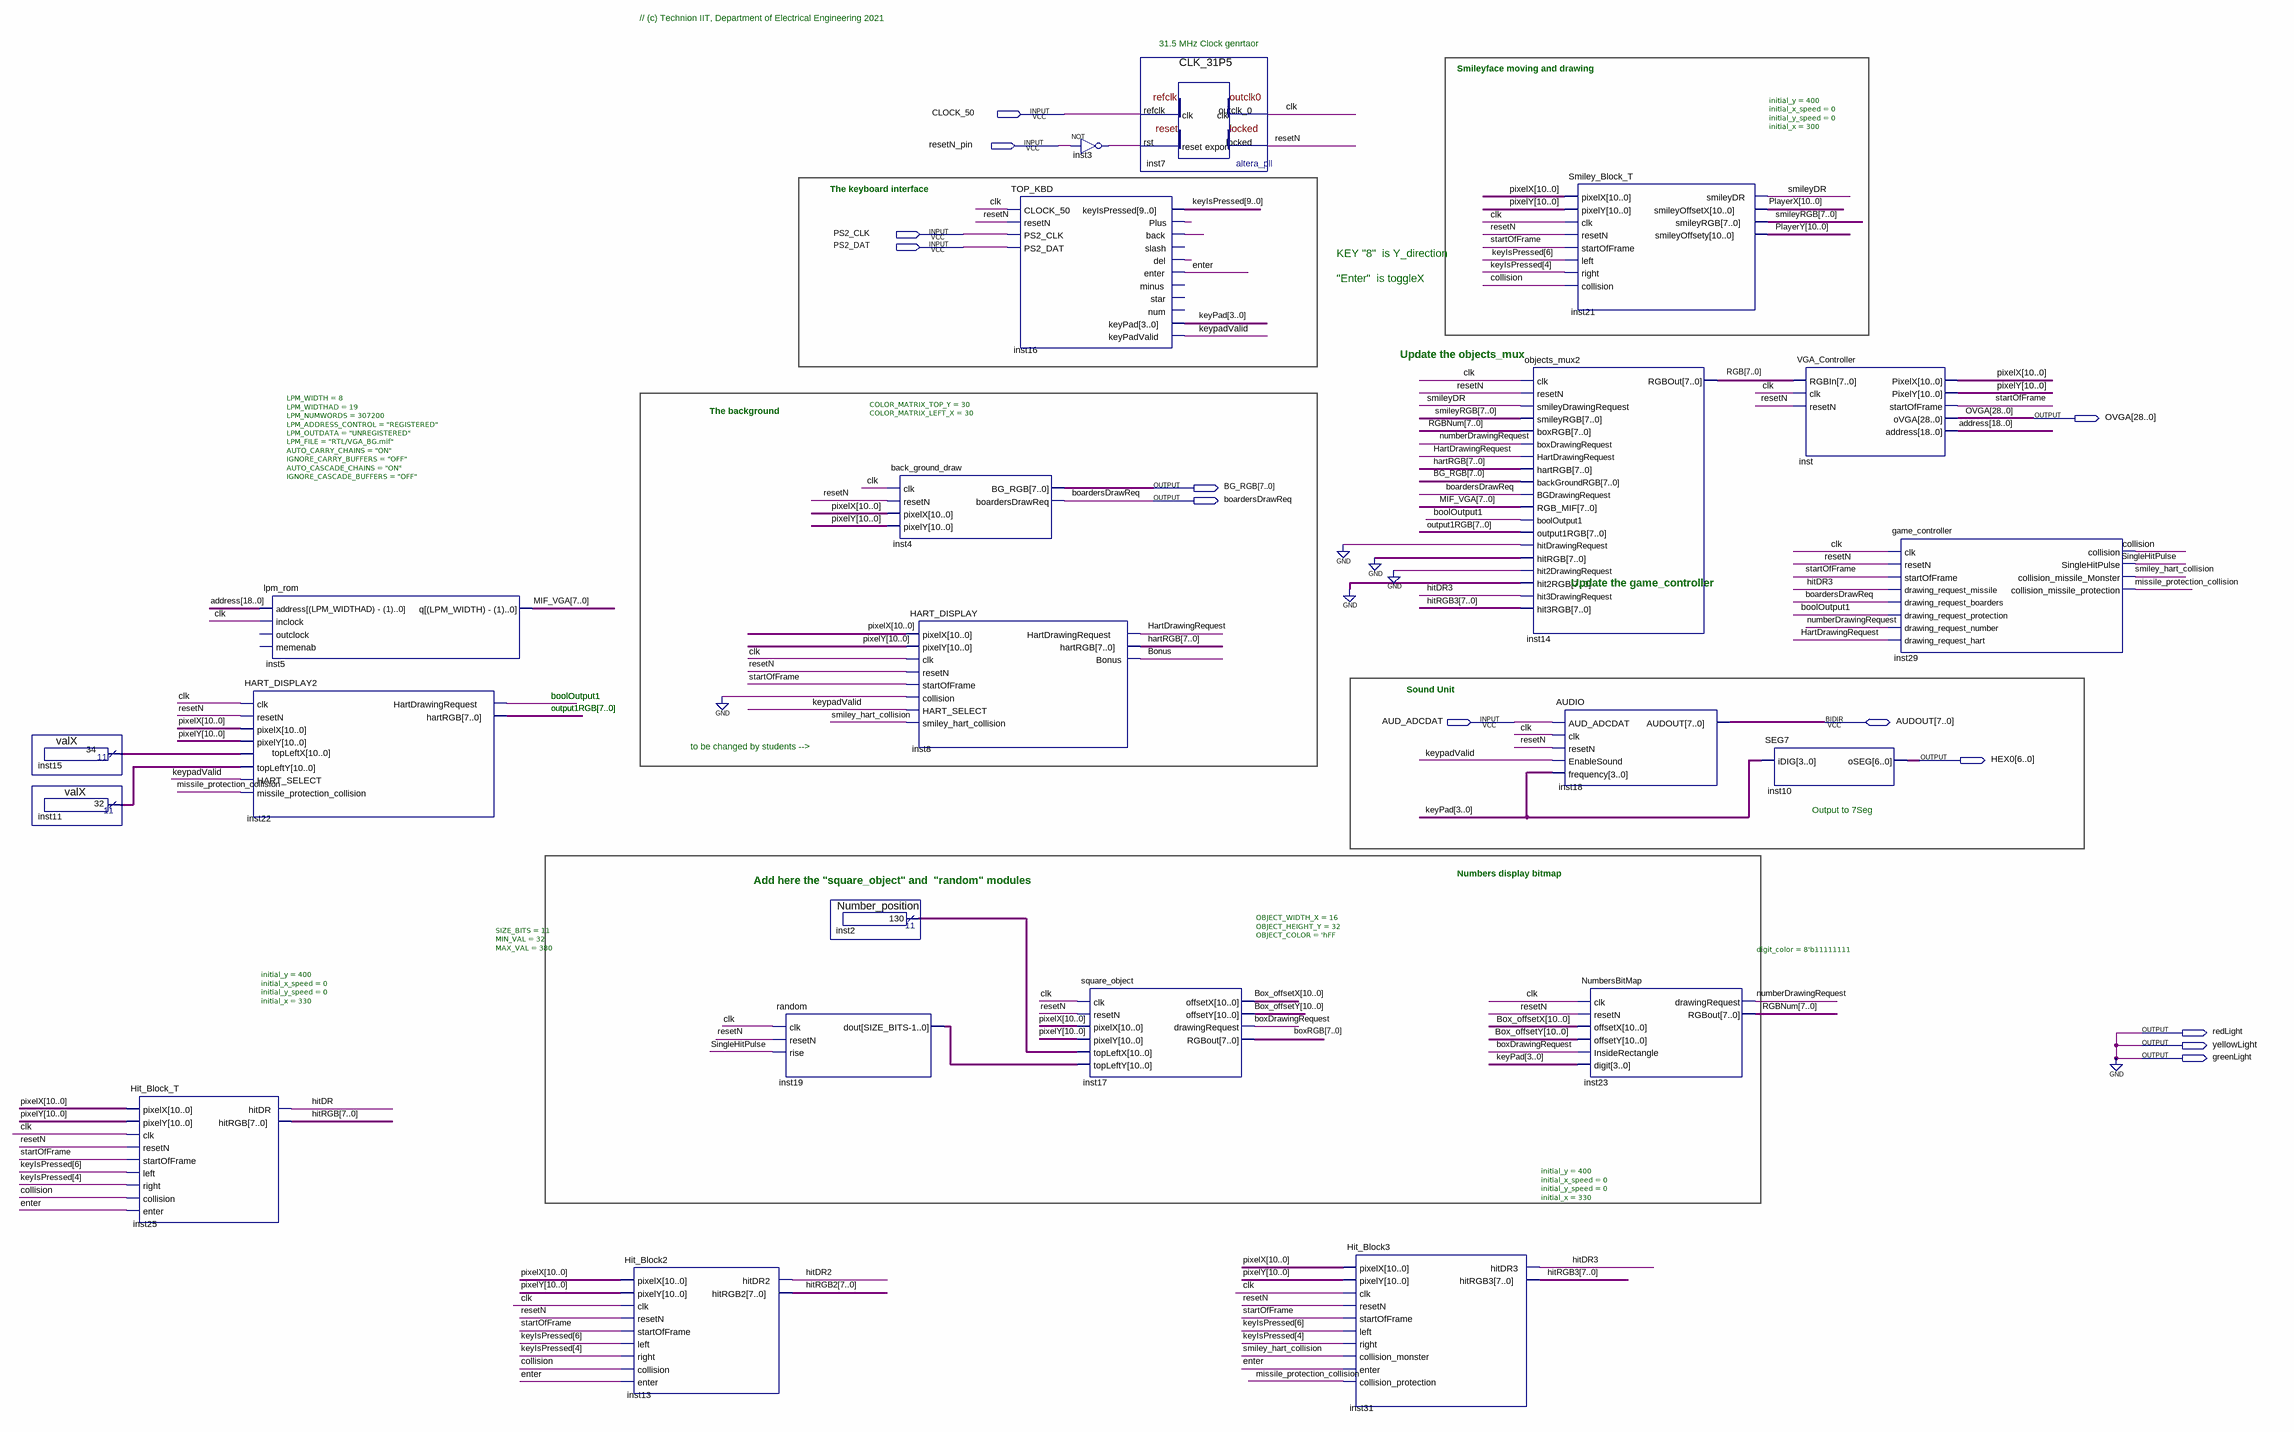
[diagram p0: schematic sheet]
// Quartus schematic TOP_VGA_DEMO_KBD.bdf as structural Verilog: 22 symbols, 13 pins
module TOP_VGA_DEMO_KBD (
  input  CLOCK_50,
  input  resetN_pin,
  input  PS2_CLK,
  input  PS2_DAT,
  input  AUD_ADCDAT,
  inout  [7:0] AUDOUT,
  output [28:0] OVGA,
  output [7:0] BG_RGB,
  output boardersDrawReq,
  output [6:0] HEX0,
  output redLight,
  output yellowLight,
  output greenLight
);

  wire Bonus, boolOutput1, boxDrawingRequest, clk, collision, enter, HartDrawingRequest, hitDR, hitDR2,
       hitDR3, inst3_out, inst16_back, inst16_del, inst16_plus, keypadValid, missile_protection_collision,
       numberDrawingRequest, resetN, SingleHitPulse, smiley_hart_collision, smileyDR, startOfFrame;
  wire [3:0] keyPad;
  wire [7:0] boxRGB, hartRGB, hitRGB, hitRGB2, hitRGB3, MIF_VGA, output1RGB, RGB, RGBNum, smileyRGB;
  wire [9:0] keyIsPressed;
  wire [10:0] Box_offsetX, Box_offsetY, inst2_result, inst11_result, inst15_result, inst19_dout, pixelX,
       pixelY, PlayerX, PlayerY;
  wire [18:0] address;

  valX inst15 (.result(inst15_result));
  valX inst11 (.result(inst11_result));
  Hit_Block_T #(.initial_y(400), .initial_x_speed(0), .initial_y_speed(0), .initial_x(330)) inst25 (
    .pixelX(pixelX), .pixelY(pixelY), .clk(clk), .resetN(resetN), .startOfFrame(startOfFrame),
    .left(keyIsPressed[6]), .right(keyIsPressed[4]), .collision(collision), .enter(enter), .hitDR(hitDR),
    .hitRGB(hitRGB));
  lpm_rom #(.LPM_WIDTH(8), .LPM_WIDTHAD(19), .LPM_NUMWORDS(307200), .LPM_ADDRESS_CONTROL("REGISTERED"), .LPM_OUTDATA("UNREGISTERED"), .LPM_FILE("RTL/VGA_BG.mif"), .AUTO_CARRY_CHAINS("ON"), .IGNORE_CARRY_BUFFERS("OFF"), .AUTO_CASCADE_CHAINS("ON"), .IGNORE_CASCADE_BUFFERS("OFF")) inst5 (
    .address(address), .inclock(clk), .q(MIF_VGA));  // open: outclock, memenab
  HART_DISPLAY2 inst22 (
    .clk(clk), .resetN(resetN), .pixelX(pixelX), .pixelY(pixelY), .topLeftX(inst15_result),
    .topLeftY(inst11_result), .HART_SELECT(keypadValid),
    .missile_protection_collision(missile_protection_collision), .HartDrawingRequest(boolOutput1),
    .hartRGB(output1RGB));
  Hit_Block2 inst13 (
    .pixelX(pixelX), .pixelY(pixelY), .clk(clk), .resetN(resetN), .startOfFrame(startOfFrame),
    .left(keyIsPressed[6]), .right(keyIsPressed[4]), .collision(collision), .enter(enter), .hitDR2(hitDR2),
    .hitRGB2(hitRGB2));
  random #(.SIZE_BITS(11), .MIN_VAL(32), .MAX_VAL(380)) inst19 (
    .clk(clk), .resetN(resetN), .rise(SingleHitPulse), .dout(inst19_dout));
  Number_position inst2 (.result(inst2_result));
  back_ground_draw #(.COLOR_MATRIX_TOP_Y(30), .COLOR_MATRIX_LEFT_X(30)) inst4 (
    .clk(clk), .resetN(resetN), .pixelX(pixelX), .pixelY(pixelY), .BG_RGB(BG_RGB),
    .boardersDrawReq(boardersDrawReq));
  HART_DISPLAY inst8 (
    .pixelX(pixelX), .pixelY(pixelY), .clk(clk), .resetN(resetN), .startOfFrame(startOfFrame),
    .collision(1'b0), .HART_SELECT(keypadValid), .smiley_hart_collision(smiley_hart_collision),
    .HartDrawingRequest(HartDrawingRequest), .hartRGB(hartRGB), .Bonus(Bonus));
  TOP_KBD inst16 (
    .CLOCK_50(clk), .resetN(resetN), .PS2_CLK(PS2_CLK), .PS2_DAT(PS2_DAT), .keyIsPressed(keyIsPressed),
    .Plus(inst16_plus), .back(inst16_back), .del(inst16_del), .enter(enter), .keyPad(keyPad),
    .keyPadValid(keypadValid));  // open: slash, minus, star, num
  not inst3 (inst3_out, resetN_pin);
  square_object #(.OBJECT_WIDTH_X(16), .OBJECT_HEIGHT_Y(32), .OBJECT_COLOR('hFF)) inst17 (
    .clk(clk), .resetN(resetN), .pixelX(pixelX), .pixelY(pixelY), .topLeftX(inst2_result),
    .topLeftY(inst19_dout), .offsetX(Box_offsetX), .offsetY(Box_offsetY), .drawingRequest(boxDrawingRequest),
    .RGBout(boxRGB));
  CLK_31P5 inst7 (.refclk(CLOCK_50), .rst(inst3_out), .outclk_0(clk), .locked(resetN));
  Hit_Block3 #(.initial_y(400), .initial_x_speed(0), .initial_y_speed(0), .initial_x(330)) inst31 (
    .pixelX(pixelX), .pixelY(pixelY), .clk(clk), .resetN(resetN), .startOfFrame(startOfFrame),
    .left(keyIsPressed[6]), .right(keyIsPressed[4]), .collision_monster(smiley_hart_collision),
    .enter(enter), .collision_protection(missile_protection_collision), .hitDR3(hitDR3), .hitRGB3(hitRGB3));
  objects_mux2 inst14 (
    .clk(clk), .resetN(resetN), .smileyDrawingRequest(smileyDR), .smileyRGB(smileyRGB), .boxRGB(RGBNum),
    .boxDrawingRequest(numberDrawingRequest), .HartDrawingRequest(HartDrawingRequest), .hartRGB(hartRGB),
    .backGroundRGB(BG_RGB), .BGDrawingRequest(boardersDrawReq), .RGB_MIF(MIF_VGA), .boolOutput1(boolOutput1),
    .output1RGB(output1RGB), .hitDrawingRequest(1'b0), .hitRGB({8{1'b0}}), .hit2DrawingRequest(1'b0),
    .hit2RGB({8{1'b0}}), .hit3DrawingRequest(hitDR3), .hit3RGB(hitRGB3), .RGBOut(RGB));
  Smiley_Block_T #(.initial_y(400), .initial_x_speed(0), .initial_y_speed(0), .initial_x(300)) inst21 (
    .pixelX(pixelX), .pixelY(pixelY), .clk(clk), .resetN(resetN), .startOfFrame(startOfFrame),
    .left(keyIsPressed[6]), .right(keyIsPressed[4]), .collision(collision), .smileyDR(smileyDR),
    .smileyOffsetX(PlayerX), .smileyRGB(smileyRGB), .smileyOffsety(PlayerY));
  AUDIO inst18 (
    .AUD_ADCDAT(AUD_ADCDAT), .clk(clk), .resetN(resetN), .EnableSound(keypadValid), .frequency(keyPad),
    .AUDOUT(AUDOUT));
  NumbersBitMap #(.digit_color(8'b11111111)) inst23 (
    .clk(clk), .resetN(resetN), .offsetX(Box_offsetX), .offsetY(Box_offsetY),
    .InsideRectangle(boxDrawingRequest), .digit(keyPad), .drawingRequest(numberDrawingRequest),
    .RGBout(RGBNum));
  VGA_Controller inst (
    .RGBIn(RGB), .clk(clk), .resetN(resetN), .PixelX(pixelX), .PixelY(pixelY), .startOfFrame(startOfFrame),
    .oVGA(OVGA), .address(address));
  SEG7 inst10 (.iDIG(keyPad), .oSEG(HEX0));
  game_controller inst29 (
    .clk(clk), .resetN(resetN), .startOfFrame(startOfFrame), .drawing_request_missile(hitDR3),
    .drawing_request_boarders(boardersDrawReq), .drawing_request_protection(boolOutput1),
    .drawing_request_number(numberDrawingRequest), .drawing_request_hart(HartDrawingRequest),
    .collision(collision), .SingleHitPulse(SingleHitPulse),
    .collision_missile_Monster(smiley_hart_collision),
    .collision_missile_protection(missile_protection_collision));

  assign greenLight = 1'b0;
  assign redLight = 1'b0;
  assign yellowLight = 1'b0;

  // Notes on the sheet:
  //   // (c) Technion IIT, Department of Electrical Engineering 2021
  //   31.5 MHz Clock genrtaor
  //   Smileyface moving and drawing
  //   The keyboard interface
  //   KEY "8"  is Y_direction
  //   "Enter"  is toggleX
  //   Update the objects_mux
  //   The background
  //   Update the game_controller
  //   Sound Unit
  //   boolOutput1
  //   output1RGB[7..0]
  //   to be changed by students -->
  //   Output to 7Seg
  //   Numbers display bitmap
  //   Add here the "square_object" and  "random" modules
endmodule
